# EasyEDA Pro project Led strip project Schematic &PCB.eprj, board PCB6
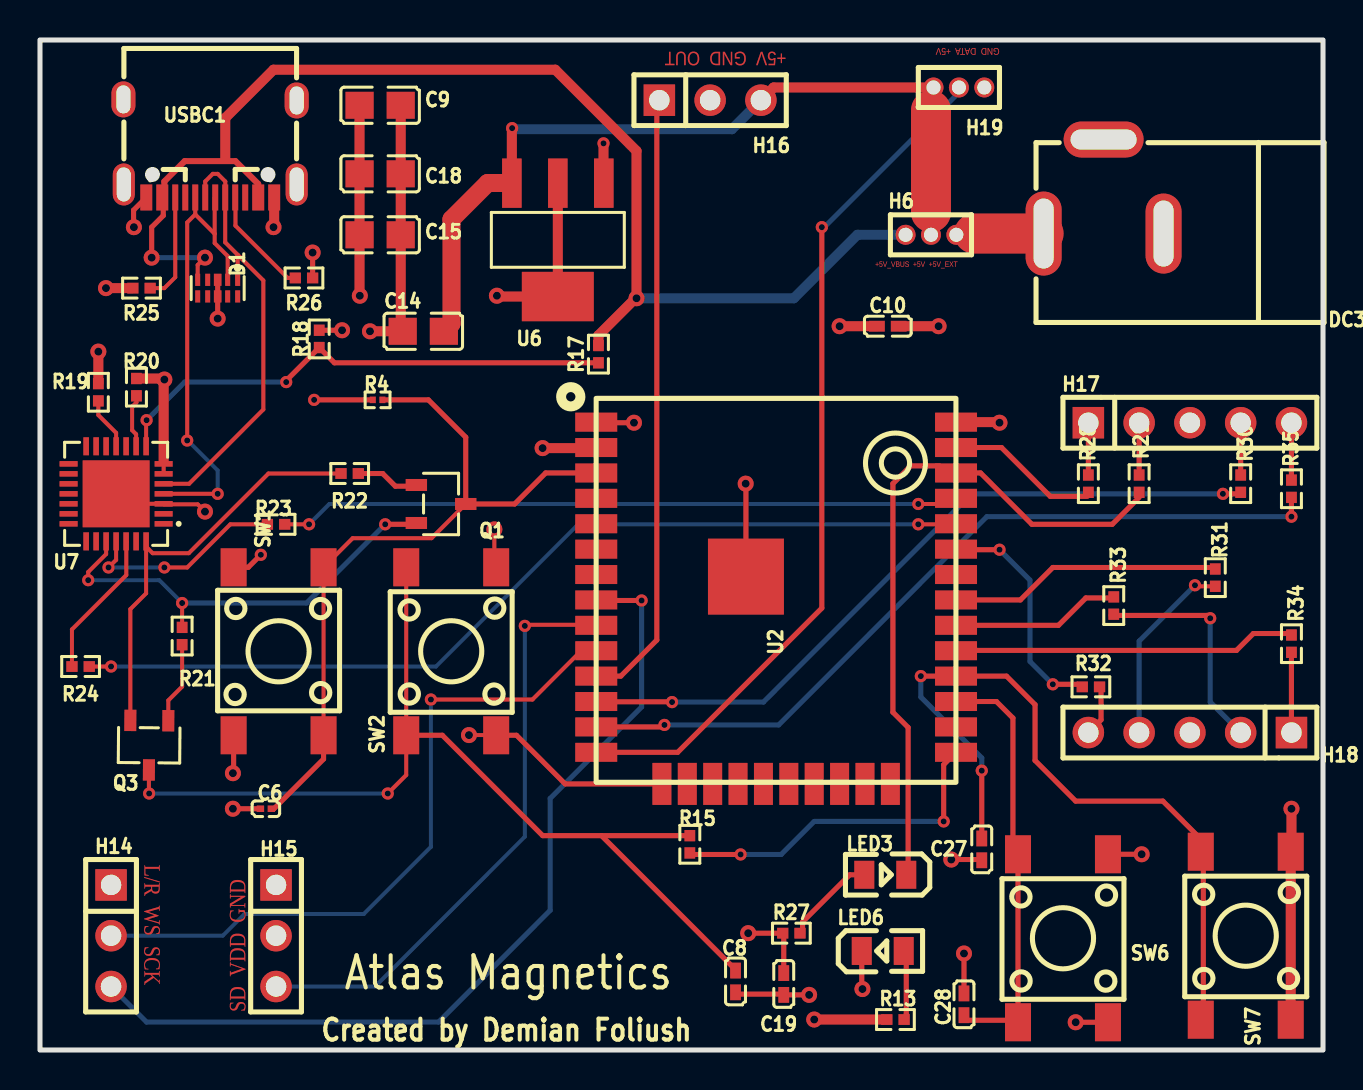
[diagram p2: board, top side]
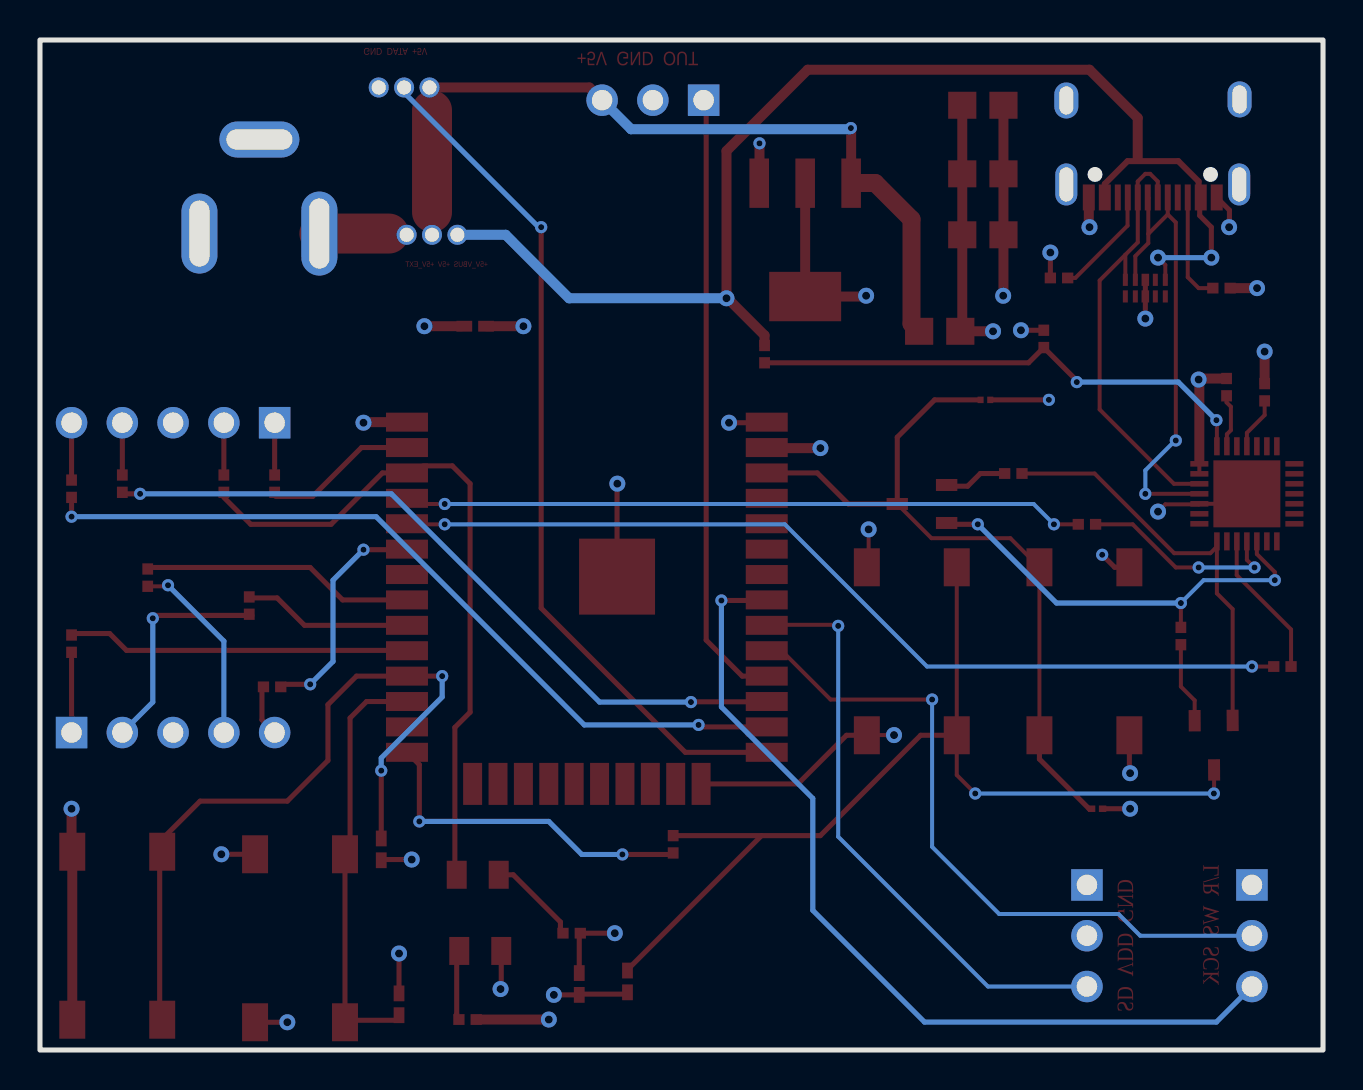
[diagram p3: board, bottom side, seen from below]

Outline 64.19 x 50.51 mm; copper layers: Top Layer, Inner1, Inner2, Bottom Layer. Coordinates in mm from the lower left corner of the outline.
Outline path: rectangle 0,50.51 64.19,0
Stack: Top Layer 0.035mm / Dielectric1 0.48mm PP er 4.5 / Inner1 0.035mm / Dielectric2 0.48mm FR4 er 4.5 / Inner2 0.035mm / Dielectric3 0.48mm PP er 4.5 / Bottom Layer 0.035mm

## Design rules (mm)
template: Custom Config
spacing copperThickness1oz (default): track to track 0.2, other pairs 0.124 to 0.3
spacing copperThickness2oz: track to track 0.203, other pairs 0.152 to 0.3
track width copperThickness1oz (default): min 0.127, default 0.254, max 2.54
track width copperThickness2oz: min 0.203, default 0.254, max 2.54
differential pair differentialPair (default): width min 0.127, default 0.254, max 2.54; gap min 0.152, default 0.152
via viaSize (default): diameter min 0.5, default 0.61, max 10; hole min 0.3, default 0.305, max 6.299

## Placement (name value [footprint] x y rotation side)
C6  1000nF  [C0201]  11.3 12.06 180 top
C8  100nF  [C0402]  34.8 3.43 90 top
C9  100nF  [C0805]  17.02 47.24 0 top
C10  22uF  [C0402]  42.42 36.19 0 top
C14  10uF  [C0805]  19.18 35.94 0 top
C15  10uF  [C0805]  17.02 40.77 180 top
C18  4.7uF  [C0805]  17.02 43.81 180 top
C19  100nF  [C0402]  37.21 3.3 90 top
C27  100nF  [C0402]  47.12 10.03 90 top
C28  100nF  [C0402]  46.23 2.29 270 top
D1  TPD4E02B04DQAR  [USON-10_L2.5-W1.0-P0.50-BL]  8.89 38.1 180 top
DC3  DC-005-5A-2.5  [DC-IN-TH_DC-005-5A-2.5]  53.21 43.18 180 top
H6  B-2101S03P-A110  [HDR-TH_3P-P1.27-V-M-1]  44.58 40.77 0 top
H14  -  [HDR-TH_3P-P2.54-V-F]  3.56 5.71 270 top
H15  -  [HDR-TH_3P-P2.54-V-F]  11.81 5.71 270 top
H16  -  [HDR-TH_3P-P2.54-V-F]  33.53 47.5 0 top
H17  -  [HDR-TH_5P-P2.54-V-F]  57.53 31.37 0 top
H18  -  [HDR-TH_5P-P2.54-V-F]  57.53 15.87 180 top
H19  B-2101S03P-A110  [HDR-TH_3P-P1.27-V-M-1]  45.97 48.13 0 top
LED3  NCD0805B2  [LED0805-R-RD]  42.29 8.76 180 top
LED6  NCD0805G1  [LED0805-R-RD]  42.16 4.95 0 top
Q1  SS8050-G  [SOT-23-3_L2.9-W1.6-P1.90-LS2.8-BR]  20.07 27.3 180 top
Q3  SS8050-G  [SOT-23-3_L2.9-W1.6-P1.90-LS2.8-BR]  5.46 15.24 89.5 top
R4  10K  [R0201]  16.89 32.51 180 top
R13  5.1kΩ  [R0402]  42.8 1.52 180 top
R15  22Ω  [R0402]  32.51 10.29 90 top
R17  22.1kΩ  [R0402]  27.94 34.8 90 top
R18  47.5kΩ  [R0402]  13.97 35.56 270 top
R19  10kΩ  [R0402]  2.92 32.89 270 top
R20  1kΩ  [R0402]  4.83 33.15 90 top
R21  10kΩ  [R0402]  7.11 20.7 90 top
R22  10kΩ  [R0402]  15.49 28.83 180 top
R23  0Ω  [R0402]  11.81 26.29 180 top
R24  0Ω  [R0402]  2.03 19.18 180 top
R25  5.1kΩ  [R0402]  5.08 38.1 180 top
R26  5.1kΩ  [R0402]  13.21 38.61 180 top
R27  40Ω  [R0402]  37.59 5.84 180 top
R28  150Ω  [R0402]  52.45 28.32 90 top
R29  150Ω  [R0402]  54.99 28.32 90 top
R30  150Ω  [R0402]  60.07 28.32 90 top
R31  150Ω  [R0402]  58.8 23.62 90 top
R32  150Ω  [R0402]  52.58 18.16 180 top
R33  150Ω  [R0402]  53.72 22.22 90 top
R34  150Ω  [R0402]  62.61 20.32 90 top
R35  150Ω  [R0402]  62.61 28.07 90 top
SW1  PTS645SH50SMTR92LFS  [KEY-SMD_4P-L6.0-W6.0-P4.50-LS9.0]  11.94 19.94 270 top
SW2  PTS645SH50SMTR92LFS  [KEY-SMD_4P-L6.0-W6.0-P4.50-LS9.0]  20.57 19.94 90 top
SW6  PTS645SH50SMTR92LFS  [KEY-SMD_4P-L6.0-W6.0-P4.50-LS9.0]  51.18 5.59 90 top
SW7  PTS645SH50SMTR92LFS  [KEY-SMD_4P-L6.0-W6.0-P4.50-LS9.0]  60.32 5.71 90 top
U2  ESP32-WROOM-32U-N4  [WIFIM-SMD_38P-L19.2-W18.0-P1.27]  36.83 22.35 90 top
U6  AMS1117-3.3  [SOT-223-4_L6.5-W3.5-P2.30-LS7.0-BR]  25.91 40.51 90 top
U7  CP2102N-A02-GQFN28R  [QFN-28_L5.0-W5.0-P0.50-TL-EP3.3]  3.81 27.81 180 top
USBC1  918-418K2023S40001  [USB-C-SMD_TYPE-C-USB-17]  8.51 45.08 180 top

## Footprints (pads in the part's own frame, mm; a bottom-side part is the same pattern mirrored in y, then rotated)
C0201
  rect 0.368x0.324 smd: 1(-0.275,0) 2(0.275,0)
C0402
  rect 0.79x0.54 smd: 1(-0.545,0) 2(0.545,0)
C0805
  rect 1.41x1.35 smd: 1(-1.03,0) 2(1.03,0)
DC-IN-TH_DC-005-5A-2.5
  oval 1.8x4.2 hole 1x3.5: 1(3,2.352)
  oval 1.8x4 hole 1x3.3: 2(-3,2.352)
  oval 4x1.8 hole 3.3x1: 3(-0.001,-2.352)
HDR-TH_3P-P1.27-V-M-1
  round 1 hole 0.7: 1(-1.27,0) 2(0,0) 3(1.27,0)
HDR-TH_3P-P2.54-V-F
  rect 1.575x1.575 hole 1.02: 1(-2.54,0)
  round 1.575 hole 1.02: 2(0,0) 3(2.54,0)
HDR-TH_5P-P2.54-V-F
  rect 1.575x1.575 hole 1.02: 1(-5.08,0)
  round 1.575 hole 1.02: 2(-2.54,0) 3(0,0) 4(2.54,0) 5(5.08,0)
KEY-SMD_4P-L6.0-W6.0-P4.50-LS9.0
  rect 1.9x1.3 smd: 1(-4.2,2.25) 2(4.2,2.25) 3(-4.2,-2.25) 4(4.2,-2.25)
LED0805-R-RD
  rect 1x1.399 smd: 1(1.05,0) 2(-1.05,0)
QFN-28_L5.0-W5.0-P0.50-TL-EP3.3
  rect 0.905x0.28 smd: 1(-2.377,1.5) 2(-2.377,1) 3(-2.377,0.5) 4(-2.377,0) 5(-2.377,-0.5) 6(-2.377,-1) 7(-2.377,-1.5) 15(2.377,-1.5) 16(2.377,-1) 17(2.377,-0.5) 18(2.377,0) 19(2.377,0.5) 20(2.377,1) 21(2.377,1.5)
  rect 0.28x0.905 smd: 8(-1.5,-2.377) 9(-1,-2.377) 10(-0.5,-2.377) 11(0,-2.377) 12(0.5,-2.377) 13(1,-2.377) 14(1.5,-2.377) 22(1.5,2.377) 23(1,2.377) 24(0.5,2.377) 25(0,2.377) 26(-0.5,2.377) 27(-1,2.377) 28(-1.5,2.377)
  rect 3.35x3.35 smd: 29(0,0)
R0201
  rect 0.303x0.324 smd: 1(-0.241,0) 2(0.241,0)
R0402
  rect 0.566x0.54 smd: 1(-0.433,0) 2(0.433,0)
SOT-23-3_L2.9-W1.6-P1.90-LS2.8-BR
  rect 1.07x0.6 smd: 1(1.235,-0.95) 2(1.235,0.95) 3(-1.235,0)
SOT-223-4_L6.5-W3.5-P2.30-LS7.0-BR
  rect 2.47x0.98 smd: 1(2.835,-2.3) 2(2.835,0) 3(2.835,2.3)
  rect 2.47x3.6 smd: 4(-2.835,0)
USB-C-SMD_TYPE-C-USB-17
  oval 1.1x2.1 hole 0.7x1.7: 0(-4.334,1.802) 0(4.316,1.802)
  oval 1.2x1.8 hole 0.7x1.4: 0(-4.334,-2.398) 0(4.334,-2.453)
  rect 0.6x1.3 smd: A1(-3.209,2.451) A4(-2.409,2.451) A9(2.391,2.452) A12(3.191,2.451)
  rect 0.3x1.3 smd: A5(-1.259,2.451) A6(-0.259,2.451) A7(0.241,2.451) A8(1.24,2.453) B5(1.741,2.451) B6(0.741,2.451) B7(-0.759,2.451) B8(-1.759,2.453)
USON-10_L2.5-W1.0-P0.50-BL
  rect 0.25x0.609 smd: 1(-1,-0.414) 2(-0.5,-0.414) 4(0.5,-0.414) 5(1,-0.414) 6(1,0.414) 7(0.5,0.414) 9(-0.5,0.414) 10(-1,0.414)
  rect 0.38x0.609 smd: 3(0,-0.414) 8(0,0.414)
WIFIM-SMD_38P-L19.2-W18.0-P1.27
  rect 0.95x2.1 smd: 1(9.045,9) 2(7.775,9) 3(6.505,9) 4(5.235,9) 5(3.965,9) 6(2.695,9) 7(1.425,9) 8(0.155,9) 9(-1.115,9) 10(-2.385,9) 11(-3.655,9) 12(-4.925,9) 13(-6.195,9) 14(-7.465,9) 25(-7.465,-9) 26(-6.195,-9) 27(-4.925,-9) 28(-3.655,-9) 29(-2.385,-9) 30(-1.115,-9) 31(0.155,-9) 32(1.425,-9) 33(2.695,-9) 34(3.965,-9) 35(5.235,-9) 36(6.505,-9) 37(7.775,-9) 38(9.045,-9)
  rect 2.1x0.95 smd: 15(-9.045,5.715) 16(-9.045,4.445) 17(-9.045,3.175) 18(-9.045,1.905) 19(-9.045,0.635) 20(-9.045,-0.635) 21(-9.045,-1.905) 22(-9.045,-3.175) 23(-9.045,-4.445) 24(-9.045,-5.715)
  rect 3.8x3.8 smd: 39(1.321,1.51)

## Nets
As in the schematic.

Pads without a net: D1 4 6 7 9 10; U2 32; U7 1 2 10 12 13 14 15 16 17 18 19 20 21 22 23 27; USBC1 0 A8 B8

## Via types
v1: diameter 0.61, hole 0.305, Top Layer to Bottom Layer, 35 vias
v2: diameter 0.8, hole 0.4, Top Layer to Bottom Layer, 34 vias

## Routing (per net, layer and track width the routed paths; a pad name or vN(x,y) marks a point on that pad's centre or on a via; arc(x,y) is an arc through that point)
+3V3: length 38.8
  Top Layer w0.2: U7.7 U7.6
  Top Layer w0.254: v2(35.43,5.84) R27.2 37.21,5.79 C19.2 ; v1(13.72,32.51) 16.53,32.51
  Top Layer w0.5: v2(22.86,37.72) 22.9,37.68 U6.4 U6.2 ; v2(40,36.19) C10.1 ; 6.19,29.46 6.19,33.49 v2(6.22,33.53) 6.17,33.58 4.83,33.58 ; v2(25.15,30.1) 27.8,30.1 U2.2 ; C9.1 C18.2 C15.2 15.99,37.72 ; v2(38.73,1.52) 42.14,1.52
  vias: v2(16,37.72)
+5V: length 39.4
  Top Layer w0.5: H19.1 36.7,48.13 H16.3 ; v1(23.62,46.1) 23.61,46.09 U6.3
  Top Layer w0.9: U6.3 23.6,43.36 22.4,43.36 20.59,41.54 20.59,36.32 C14.2
  Top Layer w2: 44.58,41.9 44.58,46.99
  Bottom Layer w0.5: v1(23.62,46.1) 23.68,46.05 34.62,46.05 H16.3
+5V_EXT: length 3.5
  Top Layer w2: DC3.1 46.74,40.83
+5V_VBUS: length 64.8
  Top Layer w0.2: v2(8.25,39.62) 7.89,39.26 D1.5
  Top Layer w0.254: USBC1.A9 6.17,42.58 6.17,41.73 5.59,41.15 v2(5.59,39.62)
  Top Layer w0.3: USBC1.A4 10.92,43.31 9.78,44.45 7.24,44.45 6.22,43.43 6.22,42.64 6.17,42.58
  Top Layer w0.5: R17.2 27.94,35.74 29.79,37.59 v2(29.84,37.59) 29.84,44.96 25.78,49.02 11.68,49.02 9.27,46.61 9.27,44.58
  Bottom Layer w0.254: 5.71,39.62 v2(8.25,39.62)
  Bottom Layer w0.5: H6.1 40.89,40.77 37.72,37.59 v2(29.84,37.59)
GND: length 81.4
  Top Layer w0.2: SW2.3 22.81,15.75 v2(21.46,15.75) ; v2(8.25,26.92) 7.89,27.29 6.21,27.29 U7.3 4.31,27.31 U7.29 ; SW2.4 22.73,24.23 v2(22.73,26.03)
  Top Layer w0.254: SW6.4 v2(55.12,9.79) ; v2(29.72,31.37) 27.86,31.37 U2.1 ; SW2.3 23.84,15.74 26.27,13.31 U2.15 ; SW6.3 v2(51.82,1.39) ; SW1.3 10.42,24.14 v1(11.05,24.76) ; R26.1 v2(13.64,39.88) ; LED6.2 41.11,3.08 v2(41.15,3.05) ; R18.1 v2(15.11,35.99) ; v2(46.23,4.83) 46.23,3.05 ; U2.39 35.32,28.31 v2(35.31,28.32) ; C6.2 v2(9.65,12.06) ; 34.8,2.79 37.17,2.79 C19.1 v2(38.48,2.76) ; C27.1 47.08,9.52 v2(45.59,9.52) ; SW1.4 9.69,13.72 ; USBC1.A12 4.68,42 4.68,41.13 v2(4.7,41.15) ; v2(8.89,36.58) D1.8 D1.3
  Top Layer w0.5: v2(16.51,35.94) C14.1 18.05,36.04 C15.1 C18.1 C9.2 ; v2(11.68,41.15) 11.72,41.18 USBC1.A1 ; v2(62.61,12.06) 62.61,9.95 SW7.4 SW7.3 ; R19.1 v2(2.92,34.92) ; v2(48.01,31.37) 47.98,31.4 U2.38 ; v2(44.96,36.19) 43.05,36.19 ; v1(28.19,45.34) 28.19,43.36 U6.1 ; R25.2 v2(3.3,38.1)
  vias: v2(9.65,13.84)
DTR: length 20.8
  Top Layer w0.2: Q3.2 4.52,22.05 5.31,22.84 5.31,25.04 ; R22.2 11.43,28.83 7.44,24.84 5.64,24.84 5.37,25.11 5.31,25.04 ; 5.31,25.04 U7.28
EN: length 37
  Top Layer w0.2: SW1.2 SW1.1 15.64,25.59 19.59,25.59 Q1.3
  Top Layer w0.254: SW1.2 14.19,14.55 11.7,12.06 C6.1 ; 17.22,32.51 19.43,32.51 21.3,30.64 Q1.3 23.75,27.3 25.3,28.86 U2.3
IO0: length 17.1
  Top Layer w0.254: U2.25 45.21,14.27 v1(45.21,11.43) ; v1(35.05,9.78) 32.51,9.78
  Bottom Layer w0.254: v1(35.05,9.78) 37.08,9.78 38.73,11.43 v1(45.21,11.43)
IO0_BTN: length 50.6
  Top Layer w0.2: Q3.3 5.45,12.84 v1(5.46,12.83) ; SW2.2 SW2.1 18.32,13.75 v1(17.4,12.83)
  Top Layer w0.254: 28.09,10.72 25.15,10.72 20.13,15.74 SW2.1 ; 28.09,10.72 32.51,10.72 ; 28.09,10.72 34.8,4.01
  Bottom Layer w0.2: v1(5.46,12.83) v1(17.4,12.83)
IO5: length 17.2
  Top Layer w0.254: U2.29 45.84,19.98 59.86,19.98 60.71,20.83 62.54,20.83 R34.2
IO12: length 43.2
  Top Layer w0.254: v1(39.12,41.15) 39.12,22.1 31.91,14.89 U2.14
  Bottom Layer w0.254: v1(39.12,41.15) 39.24,41.15 45.97,47.88 H19.2
IO14: length 39.8
  Top Layer w0.254: v1(31.24,16.26) 31.14,16.16 U2.13 ; 62.61,27.3 v1(62.61,26.67)
  Bottom Layer w0.254: v1(62.61,26.67) 47.37,26.67 36.96,16.26 v1(31.24,16.26)
IO16: length 21.3
  Top Layer w0.254: 46.23,1.49 48.83,1.49 SW6.1 SW6.2 48.68,10.04 48.68,16.6 47.85,17.43 U2.27
IO17: length 36.6
  Top Layer w0.254: v1(44.07,18.7) U2.28 48.36,18.7 49.78,17.27 49.78,14.48 51.82,12.45 56.18,12.45 58.2,10.42 58.2,2.02 ; 47.12,10.92 v1(47.12,13.97)
  Bottom Layer w0.254: v1(47.12,13.97) 47.12,14.6 44.07,17.65 v1(44.07,18.7)
IO18: length 8.5
  Top Layer w0.254: R33.2 53.67,22.61 52.32,22.61 50.95,21.24 U2.30
IO19: length 13.3
  Top Layer w0.254: U2.31 49.05,22.51 50.67,24.13 58.5,24.13
IO21: length 11.2
  Top Layer w0.254: U2.33 45.86,25.02 v1(48.01,25.02) ; v1(50.67,18.29) 51.89,18.29
  Bottom Layer w0.254: v1(48.01,25.02) 49.53,23.49 49.53,19.43 v1(50.67,18.29)
IO22: length 33.5
  Top Layer w0.254: 43.09,8.76 43.43,9.11 43.43,16.13 42.67,16.89 42.67,28.32 43.56,29.21 45.01,29.21 ; U2.36 47.06,28.86 49.63,26.29 53.65,26.29 54.99,27.63
IO23: length 7.6
  Top Layer w0.254: 52.4,27.69 50.55,27.69 48.1,30.13 U2.37
IO25: length 34.5
  Top Layer w0.2: U2.10 27.08,19.97 24.64,17.53 v1(19.56,17.53)
  Bottom Layer w0.2: H14.2 9.14,5.71 10.23,6.8 16.2,6.8 19.56,10.16 v1(19.56,17.53)
IO26: length 30.8
  Top Layer w0.254: H16.1 30.86,47.37 30.86,20.5 29.06,18.7 U2.11
IO27: length 36.6
  Top Layer w0.254: v1(31.62,17.4) 31.61,17.41 27.85,17.41 U2.12 ; v1(59.18,27.81) 60,27.81 R30.1
  Bottom Layer w0.254: v1(31.62,17.4) 36.2,17.4 46.61,27.81 v1(59.18,27.81)
IO32: length 44.7
  Top Layer w0.254: v1(30.1,22.48) 27.86,22.48 U2.8
  Bottom Layer w0.254: H14.3 5.33,1.4 19.94,1.4 25.53,6.98 25.53,12.58 30.1,17.15 v1(30.1,22.48)
IO33: length 29.7
  Top Layer w0.2: U2.9 27.8,21.26 24.31,21.26 v1(24.26,21.21)
  Bottom Layer w0.2: v1(24.26,21.21) 24.26,10.67 16.76,3.17 H15.3
RTS: length 22.1
  Top Layer w0.2: v1(2.41,23.49) 2.41,23.9 3.31,24.8 U7.24 ; R21.2 v1(7.11,22.35)
  Top Layer w0.254: Q1.2 18.76,26.29 v1(17.27,26.29)
  Bottom Layer w0.2: v1(2.41,23.49) 5.97,23.49 v1(7.11,22.35)
  Bottom Layer w0.254: v1(17.27,26.29) 13.33,22.35 v1(7.11,22.35)
RXD: length 10.3
  Top Layer w0.2: v1(6.22,24.13) 7.37,24.13 9.52,26.29 11.38,26.29 ; U7.25 3.81,24.51 v1(3.43,24.13)
  Bottom Layer w0.2: v1(6.22,24.13) v1(3.43,24.13)
RXD0: length 46.3
  Top Layer w0.2: v1(3.56,19.18) R24.1 ; U2.34 45.8,26.29 v1(43.94,26.29)
  Bottom Layer w0.2: v1(43.94,26.29) 26.92,26.29 19.81,19.18 v1(3.56,19.18)
TXD: length 7.4
  Top Layer w0.2: U7.26 4.32,25.43 4.32,23.75 1.6,21.03 R24.2
TXD0: length 34.2
  Top Layer w0.2: R23.1 v1(13.46,26.29) ; v1(43.94,27.3) 45.69,27.3 45.83,27.44 U2.35
  Bottom Layer w0.2: v1(13.46,26.29) 14.48,27.3 v1(43.94,27.3)
USB_DN: length 22.1
  Top Layer w0.2: D1.1 9.89,39.77 ; 9.89,39.77 11.18,38.48 11.18,32.03 7.46,28.31 U7.5 ; 9.89,39.77 9.27,40.39 USBC1.B7 9.27,42.64 9.27,43.43 8.89,43.81 8.65,43.81 8.27,43.43 USBC1.A7
USB_DP: length 24.1
  Top Layer w0.2: USBC1.B6 7.77,41.79 ; 7.77,41.79 8.74,40.81 ; 7.77,41.79 7.37,41.38 v1(7.37,30.48) ; 8.74,40.81 8.74,40.35 9.39,39.7 D1.2 ; 8.74,40.81 8.74,42.61 USBC1.A6 ; v1(8.89,27.81) U7.4
  Bottom Layer w0.2: v1(8.89,27.81) 8.89,28.98 7.39,30.48 v1(7.37,30.48)
$1N5917: length 3.1
  Top Layer w0.254: 43.34,4.83 43.34,1.8 43.36,1.78
$1N7816: length 4.6
  Top Layer w0.254: LED3.1 40.51,8.76 38.15,6.4 38.15,5.84
$1N15613: length 25.8
  Top Layer w0.2: v1(5.33,31.5) 5.31,31.47 U7.8
  Top Layer w0.254: v1(12.32,33.4) 12.32,33.48 R18.2 14.73,34.36 R17.1
  Bottom Layer w0.254: v1(12.32,33.4) 7.24,33.4 v1(5.33,31.5)
$1N15669: length 2.6
  Top Layer w0.2: U7.11 3.81,30.86 2.92,31.75 R19.2
$1N15732: length 2.7
  Top Layer w0.2: U7.9 4.81,30.79 4.61,30.99 4.61,32.17 4.83,32.38 R20.1
$1N16147: length 3.2
  Top Layer w0.254: Q1.1 18.77,28.19 17.78,28.19 17.14,28.83 R22.1
$1N16150: length 4.1
  Top Layer w0.2: Q3.1 6.42,17.48 7.11,18.17 R21.1
$1N31082: length 5.4
  Top Layer w0.2: 5.59,38.1 6.22,38.1 6.77,38.64 USBC1.B5
$1N31086: length 5.5
  Top Layer w0.2: R26.2 12.39,38.61 9.78,41.22 9.78,42.62 USBC1.A5
$1N35428: length 2.3
  Top Layer w0.254: H17.1 52.45,29.08
$1N35434: length 2.3
  Top Layer w0.254: H17.2 54.99,29.08
$1N35441: length 2.3
  Top Layer w0.254: 53.09,17.9 53.09,16.51 H18.5
$1N35448: length 9.6
  Top Layer w0.2: v1(57.78,23.24) 57.84,23.19 58.8,23.19 R31.1
  Bottom Layer w0.254: v1(57.78,23.24) 54.99,20.45 H18.4
$1N35465: length 2.4
  Top Layer w0.254: H17.4 60.07,28.96
$1N35471: length 2.7
  Top Layer w0.254: H17.5 62.61,28.7
$1N35478: length 11.4
  Top Layer w0.254: v1(58.55,21.59) 58.41,21.73 53.59,21.73
  Bottom Layer w0.254: H18.2 58.55,17.4 v1(58.55,21.59)
$1N35484: length 3.7
  Top Layer w0.254: 62.61,19.56 H18.1

## Copper pours and planes (outline as drawn; the poured copper is in the pictures)
+3V3 on Inner2: 0.26,50.25 63.93,50.25 63.93,0.26 0.26,0.26
GND on Inner1: 0.26,50.25 63.93,50.25 63.93,0.26 0.26,0.26

Small or netless copper shapes (teardrops, artwork), in the pictures only: 31 on Inner1, 4 on Inner2

## Text on the board
Top Layer: +5V_VBUS  +5V  +5V_EXT | GND  DATA  +5V | +5V  GND  OUT | L/R  WS  SCK | SD  VDD  GND
Top Silkscreen Layer: Created by Demian Foliush | Atlas Magnetics
